# EAGLE design T STorM32 motor v25E-sq (EAGLE 7.5.0)
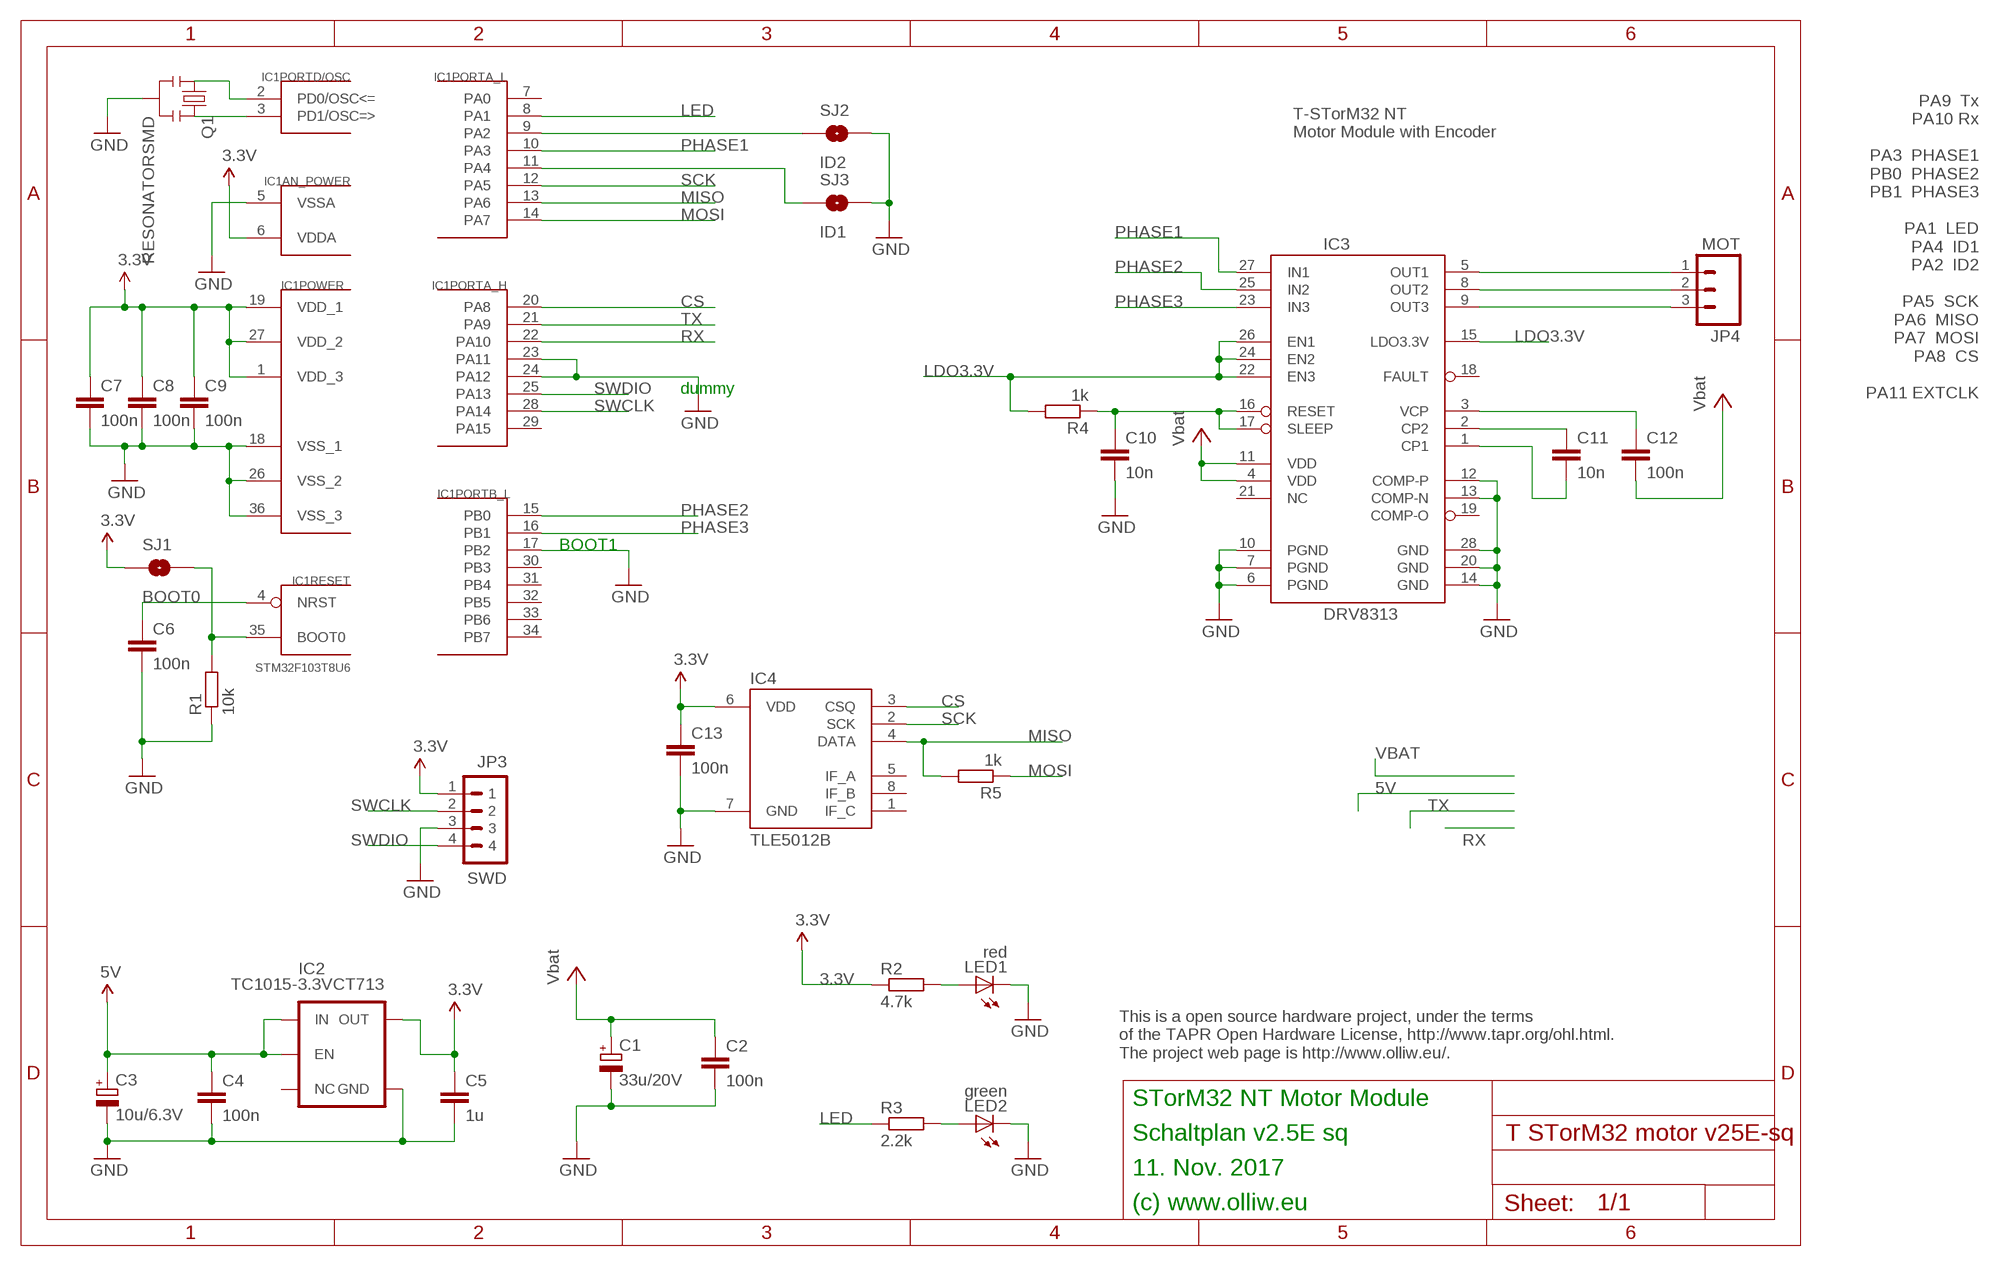
[diagram p0: schematic, sheet 1]

## Parts
C1  33u/20V  CPOL-EUSMCC  [SMC_C]
C2  100n  C-EUC0603  [C0603]
C3  10u/6.3V  CPOL-EUSMCB  [SMC_B]
C4  100n  C-EUC0603  [C0603]
C5  1u  C-EUC0603  [C0603]
C6  100n  C-EUC0603  [C0603]
C7  100n  C-EUC0603  [C0603]
C8  100n  C-EUC0603  [C0603]
C9  100n  C-EUC0603  [C0603]
C10  10n  C-EUC0603  [C0603]
C11  10n  C-EUC0603  [C0603]
C12  100n  C-EUC0603  [C0603]
C13  100n  C-EUC0603  [C0603]
IC1  STM32F103T8U6  STM32F10XTXU6  [VFQFPN36]
IC2  TC1015-3.3VCT713  V_REG_TPS76433SOT23-5  [SOT23-5]
IC3  DRV8313  [HTSSOP28]
IC4  TLE5012B  [SO08]
JP3  SWD  P4X1_1P27-OCT_BILEX  [4X1_1P27_OCT_BILEX]
JP4  MOT  M031X03_NO_SILK  [1X03_NO_SILK]
LED1  red  LEDCHIPLED_0603  [CHIPLED_0603]
LED2  green  LEDCHIPLED_0603  [CHIPLED_0603]
Q1  RESONATORSMD  [RESONATOR-SMD]
R1  10k  R-EU_R0603  [R0603]
R2  4.7k  R-EU_R0603  [R0603]
R3  2.2k  R-EU_R0603  [R0603]
R4  1k  R-EU_R0603  [R0603]
R5  1k  R-EU_R0603  [R0603]
SJ1  BOOT0  SOLDERJUMPERNO  [SJ_2S-NO]
SJ2  ID2  SOLDERJUMPERNO  [SJ_2S-NO]
SJ3  ID1  SOLDERJUMPERNO  [SJ_2S-NO]

## Nets
3.3V: C5.1 C7.1 C8.1 C9.1 C13.1 IC1.1(POWER:VDD_3) IC1.6(AN_POWER:VDDA) IC1.19(POWER:VDD_1) IC1.27(POWER:VDD_2) IC2.5(OUT) IC4.6(VDD) JP3.1 R2.1 SJ1.1
5V: C3.+ C4.1 IC2.1(IN) IC2.3(EN)
CS: IC1.20(PORTA_H:PA8) IC4.3(CSQ)
GND: C1.- C2.2 C3.- C4.2 C5.2 C6.2 C7.2 C8.2 C9.2 C10.2 C13.2 IC1.5(AN_POWER:VSSA) IC1.17(PORTB_L:PB2) IC1.18(POWER:VSS_1) IC1.23(PORTA_H:PA11) IC1.24(PORTA_H:PA12) IC1.26(POWER:VSS_2) IC1.36(POWER:VSS_3) IC2.2(GND) IC3.6(PGND) IC3.7(PGND) IC3.10(PGND) IC3.12(COMP-P) IC3.13(COMP-N) IC3.14(GND) IC3.20(GND) IC3.28(GND) IC4.7(GND) JP3.3 LED1.C LED2.C Q1.2 R1.1 SJ2.2 SJ3.2
LDO3.3V: IC3.15(LDO3.3V) IC3.22(EN3) IC3.24(EN2) IC3.26(EN1) R4.2
LED: IC1.8(PORTA_L:PA1) R3.1
M1: IC3.5(OUT1) JP4.1
M2: IC3.8(OUT2) JP4.2
M3: IC3.9(OUT3) JP4.3
MISO: IC1.13(PORTA_L:PA6) IC4.4(DATA) R5.2
MOSI: IC1.14(PORTA_L:PA7) R5.1
N$3: IC1.9(PORTA_L:PA2) SJ2.1
N$4: IC1.11(PORTA_L:PA4) SJ3.1
N$7: C6.1 IC1.4(RESET:NRST)
N$8: IC1.35(RESET:BOOT0) R1.2 SJ1.2
N$9: IC1.2(PORTD/OSC:PD0/OSC<=) Q1.1
N$10: IC1.3(PORTD/OSC:PD1/OSC=>) Q1.3
N$11: LED1.A R2.2
N$12: LED2.A R3.2
N$16: C11.1 IC3.2(CP2)
N$18: C11.2 IC3.1(CP1)
N$19: C10.1 IC3.16(RESET) IC3.17(SLEEP) R4.1
N$20: C12.1 IC3.3(VCP)
PHASE1: IC1.10(PORTA_L:PA3) IC3.27(IN1)
PHASE2: IC1.15(PORTB_L:PB0) IC3.25(IN2)
PHASE3: IC1.16(PORTB_L:PB1) IC3.23(IN3)
RX: IC1.22(PORTA_H:PA10)
SCK: IC1.12(PORTA_L:PA5) IC4.2(SCK)
SWCLK: IC1.28(PORTA_H:PA14) JP3.2
SWDIO: IC1.25(PORTA_H:PA13) JP3.4
TX: IC1.21(PORTA_H:PA9)
VBAT: C1.+ C2.1 C12.2 IC3.4(VDD) IC3.11(VDD) ; supply symbol labelled Vbat
Unconnected: IC1.7(PORTA_L:PA0) IC1.29(PORTA_H:PA15) IC1.30(PORTB_L:PB3) IC1.31(PORTB_L:PB4) IC1.32(PORTB_L:PB5) IC1.33(PORTB_L:PB6) IC1.34(PORTB_L:PB7) IC2.4(NC) IC3.18(FAULT) IC3.19(COMP-O) IC3.21(NC) IC4.1(IF_C) IC4.5(IF_A) IC4.8(IF_B)

## Notes on the sheet
- PA9  Tx
  PA10 Rx
  
  PA3  PHASE1
  PB0  PHASE2
  PB1  PHASE3
  
  PA1  LED
  PA4  ID1
  PA2  ID2
  
  PA5  SCK
  PA6  MISO
  PA7  MOSI
  PA8  CS
  
  PA11 EXTCLK
- T-STorM32 NT
  Motor Module with Encoder
- dummy
- BOOT1
- This is a open source hardware project, under the terms
  of the TAPR Open Hardware License, http://www.tapr.org/ohl.html.
  The project web page is http://www.olliw.eu/.
- STorM32 NT Motor Module
- Schaltplan v2.5E sq
- 11. Nov. 2017
- (c) www.olliw.eu

## Library data of the parts
C1 C3 = rcl:CPOL-EU: POLARIZED CAPACITOR, European symbol
C2 C4-C13 = rcl:C-EU: CAPACITOR, European symbol
IC1 = # stm32:STM32F10XTXU6: STM32F101/103 36pad VFQPFN36
IC2 = # SparkFun2:V_REG_TPS76433: Voltage Regulator Older TI part. LDO 150mA regulator. No output by-pass cap option. See V_REG_LDO for a better part.
IC3 = # stdlib:DRV8313
IC4 = # stdlib:TLE5012B
JP3 = # stdlib:P4X1_1P27
JP4 = # SparkFun2:M03: Header 3 Standard 3-pin 0.1" header. Use with straight break away headers (SKU : PRT-00116), right angle break away headers (PRT-00553), swiss pins (PRT-00743), machine pins (PRT-00117), and female headers (PRT-00115). Molex polarized connector foot print use with SKU : PRT-08232 with associated crimp pins and housings.
LED1 LED2 = led:LED: LED OSRAM: - CHIPLED LG R971, LG N971, LY N971, LG Q971, LY Q971, LO R971, LY R971 LH N974, LH R974 LS Q976, LO Q976, LY Q976 LO Q996 - Hyper CHIPLED LW Q18S LB Q993, LB Q99A, LB R99A - SideLED LS A670, LO A670, LY A670, LG A670, LP A670 LB A673, LV A673, LT A673, LW A673 LH A674 LY A675 LS A676, LA A676, LO A676, LY A676, LW A676 LS A679, LY A679, LG A679 - Hyper Micro SIDELED® LS Y876, LA Y876, LO Y876, LY Y876 LT Y87S - SmartLED LW L88C, LW L88S LB L89C, LB L89S, LG L890 LS L89K, LO L89K, LY L89K LS L896, LA L896, LO L896, LY L896 - TOPLED LS T670, LO T670, LY T670, LG T670, LP T670 LSG T670, LSP T670, LSY T670, LOP T670, LYG T670 LG T671, LOG T671, LSG T671 LB T673, LV T673, LT T673, LW T673 LH T674 LS T676, LA T676, LO T676, LY T676, LB T676, LH T676, LSB T676, LW T676 LB T67C, LV T67C, LT T67C, LS T67K, LO T67K, LY T67K, LW E67C LS E67B, LA E67B, LO E67B, LY E67B, LB E67C, LV E67C, LT E67C LW T67C LS T679, LY T679, LG T679 LS T770, LO T770, LY T770, LG T770, LP T770 LB T773, LV T773, LT T773, LW T773 LH T774 LS E675, LA E675, LY E675, LS T675 LS T776, LA T776, LO T776, LY T776, LB T776 LHGB T686 LT T68C, LB T68C - Hyper Mini TOPLED® LB M676 - Mini TOPLED Santana® LG M470 LS M47K, LO M47K, LY M47K Source: http://www.osram.convergy.de LUXEON: - LUMILED® LXK2-PW12-R00, LXK2-PW12-S00, LXK2-PW14-U00, LXK2-PW14-V00 LXK2-PM12-R00, LXK2-PM12-S00, LXK2-PM14-U00 LXK2-PE12-Q00, LXK2-PE12-R00, LXK2-PE12-S00, LXK2-PE14-T00, LXK2-PE14-U00 LXK2-PB12-K00, LXK2-PB12-L00, LXK2-PB12-M00, LXK2-PB14-N00, LXK2-PB14-P00, LXK2-PB14-Q00 LXK2-PR12-L00, LXK2-PR12-M00, LXK2-PR14-Q00, LXK2-PR14-R00 LXK2-PD12-Q00, LXK2-PD12-R00, LXK2-PD12-S00 LXK2-PH12-R00, LXK2-PH12-S00 LXK2-PL12-P00, LXK2-PL12-Q00, LXK2-PL12-R00 Source: www.luxeon.com KINGBRIGHT: KA-3528ASYC Source: www.kingbright.com
Q1 = # SparkFun2:RESONATOR: Resonator Small SMD resonator. This is the itty bitty 10/20MHz resonators with built in caps. CSTCE10M0G55 and CSTCE20M0V53. Footprint has been reviewed closely but hasn't been tested yet.
R1-R5 = rcl:R-EU_: RESISTOR, European symbol
SJ1-SJ3 = # SparkFun2:SOLDERJUMPER: Solder Jumper Standard SMD solder jumper. Used to automate production. Two varients : Normally Open and Normally Closed are the same, but have different paste layers. NC will have a large amount of paste and should jumper during reflow.

## Board
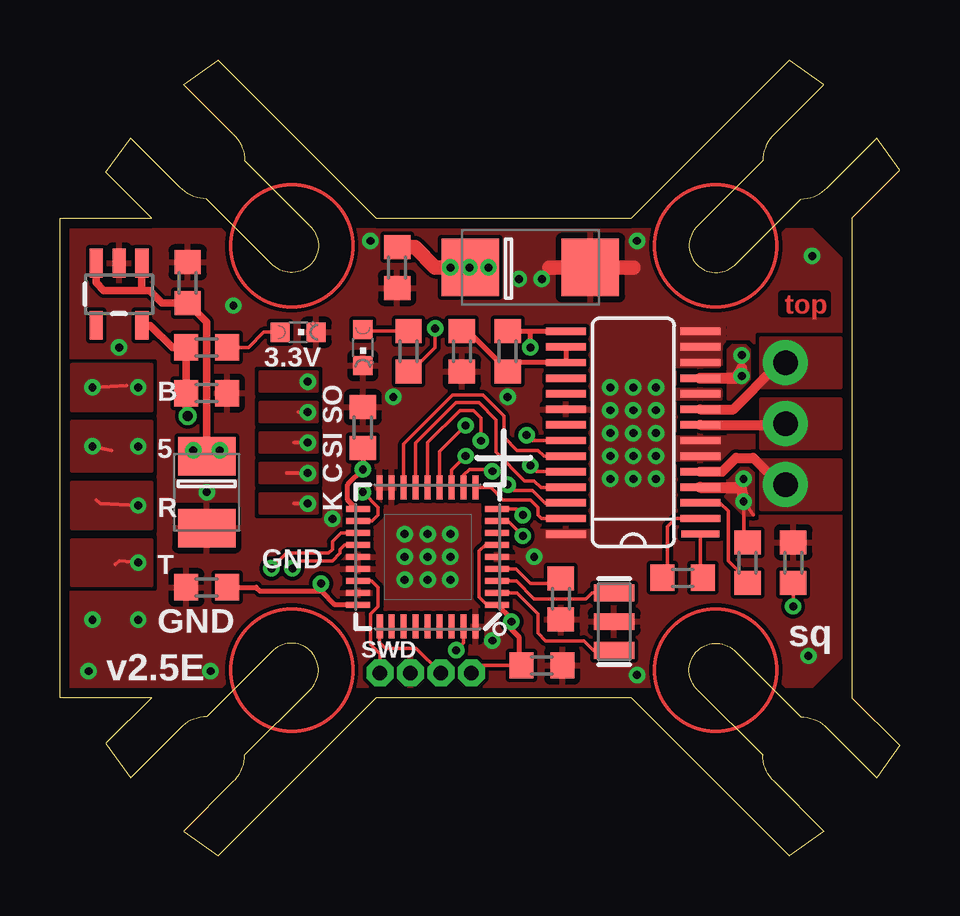
[diagram p1: board, top side]
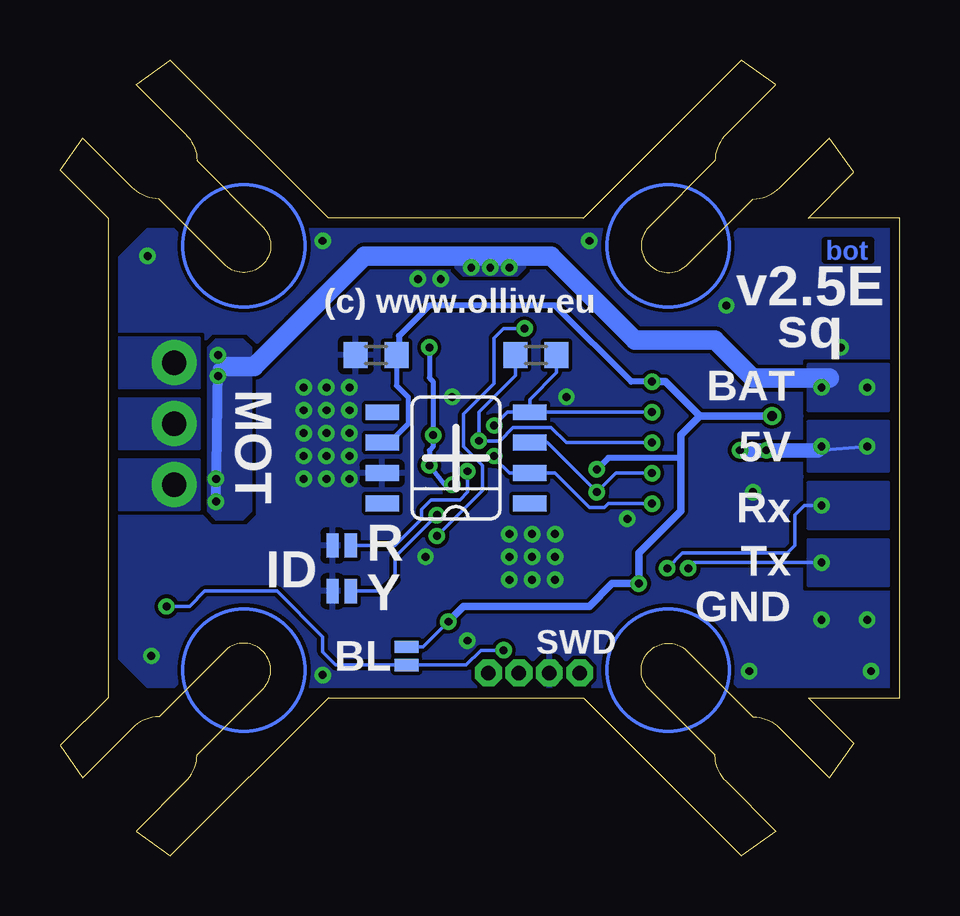
[diagram p2: board, bottom side, seen from below]

Size 35.01 x 33.18 mm. Coordinates in mm from the lower left corner, seen from the top.
Outline: 0,6.59 0,26.59 3.82,26.59 1.91,28.5 2.94,29.92 5.01,27.86 arc46 6.12,27.38 8.9,24.61 arc180 10.4,26.27 7.71,28.97 arc45 7.23,30.08 5.17,32.15 6.59,33.18 13.18,26.59 23.82,26.59 30.41,33.18 31.83,32.15 29.77,30.08 arc45 29.29,28.97 26.6,26.27 arc180 28.1,24.61 30.88,27.38 arc46 31.99,27.86 34.06,29.92 35.01,28.58 33,26.59 33,6.59 35.01,4.6 34.06,3.25 31.99,5.32 arc46 30.88,5.79 28.1,8.57 arc180 26.6,6.91 29.29,4.21 arc45 29.77,3.1 31.83,1.03 30.41,0 23.82,6.59 13.18,6.59 6.59,0 5.17,1.03 7.23,3.1 arc45 7.71,4.21 10.4,6.91 arc180 8.9,8.57 6.12,5.79 arc46 5.01,5.32 2.94,3.25 1.91,4.68 3.82,6.59 0,6.59
Copper layers (1*16): Top 0.0356mm / dielectric 1.5011mm / Bottom 0.0356mm
Design rules "ow-oshpark-2layer": minimum track width 6mil, minimum drill 13mil, track to track 6mil, track to pad 6mil, pad to pad 6mil, via to via 6mil, smd to smd 6mil, copper to edge 15mil, drill to drill 6mil, minimum pad ring 7mil, minimum via ring 7mil, stop-mask expansion 2.5mil, vias tented up to drill 26mil, thermal gap 10mil

### Footprints (pad centres in the part's own frame; a part is rotated, then mirrored left to right if it is on the bottom)
SMC_C = smd 2.4 x 2.4: + -2.5,0; - 2.5,0
C0603 = smd 1 x 1.1: 1 -0.85,0; 2 0.85,0
SMC_B = smd 1.6 x 2.4: + -1.5,0; - 1.5,0
VFQFPN36 = smd 1 x 0.25: 1 -2.9,2; 2 -2.9,1.5; 3 -2.9,1; 4 -2.9,0.5; 5 -2.9,0; 6 -2.9,-0.5; 7 -2.9,-1; 8 -2.9,-1.5; 9 -2.9,-2; 19 2.9,-2; 20 2.9,-1.5; 21 2.9,-1; 22 2.9,-0.5; 23 2.9,0; 24 2.9,0.5; 25 2.9,1; 26 2.9,1.5; 27 2.9,2 | smd 0.25 x 1: 10 -2,-2.9; 11 -1.5,-2.9; 12 -1,-2.9; 13 -0.5,-2.9; 14 0,-2.9; 15 0.5,-2.9; 16 1,-2.9; 17 1.5,-2.9; 18 2,-2.9; 29 1.5,2.9; 30 1,2.9; 31 0.5,2.9; 32 0,2.9; 33 -0.5,2.9; 34 -1,2.9; 35 -1.5,2.9; 36 -2,2.9 | smd 0.27 x 1: 28 2,2.9
SOT23-5 = smd 0.55 x 1.2: 1 -0.95,-1.3; 2 0,-1.3; 3 0.95,-1.3; 4 0.95,1.3; 5 -0.95,1.3
HTSSOP28 = smd 0.3 x 1.6: 1 0,-2.8 | smd 0.305 x 1.676: 2 0.65,-2.8; 3 1.3,-2.8; 4 1.95,-2.8; 5 2.6,-2.8; 6 3.25,-2.8; 7 3.9,-2.8; 8 4.55,-2.8; 9 5.2,-2.8; 10 5.85,-2.8; 11 6.5,-2.8; 12 7.15,-2.8; 13 7.8,-2.8; 14 8.45,-2.8; 15 8.45,2.8; 16 7.8,2.8; 17 7.15,2.8; 18 6.5,2.8; 19 5.85,2.8; 20 5.2,2.8; 21 4.55,2.8; 22 3.9,2.8; 23 3.25,2.8; 24 2.6,2.8; 25 1.95,2.8; 26 1.3,2.8; 27 0.65,2.8; 28 0,2.8
SO08 = smd 0.66 x 1.397: 1 0,-3.073; 2 1.27,-3.073; 3 2.54,-3.073; 4 3.81,-3.073; 5 3.81,3.073; 6 2.54,3.073; 7 1.27,3.073; 8 0,3.073
4X1_1P27_OCT_BILEX = drill 0.61 pad 1.118 octagon: 1 0,0; 2 0,-1.27; 3 0,-2.54; 4 0,-3.81
1X03_NO_SILK = drill 1.016 pad 1.88: 1 0,0; 2 2.54,0; 3 5.08,0
CHIPLED_0603 = smd 0.8 x 0.8: A 0,-0.75; C 0,0.75
RESONATOR-SMD = smd 0.7 x 1.7: 1 -1.2,0; 2 0,0; 3 1.2,0
R0603 = smd 1 x 1.1: 1 -0.85,0; 2 0.85,0
SJ_2S-NO = smd 0.508 x 1.016: 1 -0.381,0; 2 0.381,0

### Placement (x,y rotation side)
C1  19.61,24.53 0 top
C2  14.05,24.53 270 top
C3  6.12,15.16 270 top
C4  5.32,23.89 90 top
C5  6.12,19.29 0 top
C6  20.88,10.72 270 top
C7  6.12,11.19 180 top
C8  12.63,17.86 90 top
C9  20.09,7.94 0 top
C10  16.75,21.03 270 top
C11  25.96,11.59 0 top
C12  28.66,12.22 90 top
C13  21.83,20.88 180 bottom
IC1  15.32,12.46 180 top
IC2  2.47,23.42 180 top
IC3  23.9,13.41 90 top
IC4  18.5,14.68 90 bottom
JP3  17.15,7.62 270 top
JP4  30.25,15.48 90 top
LED1  9.93,21.83 270 top
LED2  12.63,21.19 180 top
Q1  23.1,9.76 90 top
R1  30.56,12.22 270 top
R2  6.12,21.19 0 top
R3  14.53,21.03 90 top
R4  18.66,21.03 90 top
R5  15.17,20.88 0 bottom
SJ1  20.56,8.33 270 bottom
SJ2  23.26,11.03 180 bottom
SJ3  23.26,12.94 180 bottom

### Tracks (layer width: path | path; a pad name or v marks a point on that pad's centre or on a via)
3.3V  (via drill 0.33, 0.4)
  Top 0.152: JP3.1 17.47,7.94 C9.1 19.13,8.04 | IC1.19 12.37,14.46 | IC1.6 17.73,12.96 17.47,12.7 17.47,10.8 17.8,10.46 IC1.1
  Top 0.203: 10.88,11.03 11.45,10.46 IC1.27 | 12.37,14.46 11.99,14.84 11.99,15.48 v12.63,16.11 C8.1 | C7.1 8.18,11.19 8.34,11.03 10.88,11.03 | 10.88,11.03 v10.88,11.35 | 19.13,8.04 19.13,9.13 18.82,9.45 v18.82,9.76 18.82,9.87 IC1.1
  Top 0.305: IC2.5 3.77,22.12 4.69,21.19 R2.1 C5.1 5.27,18.39 v5.32,18.34
  Bottom 0.152: IC4.6 21.28,17.22 | 20.88,20.98 C13.1 | v18.82,9.76 19.86,8.72 SJ1.1
  Bottom 0.203: 21.28,17.22 20.48,18.02 20.48,19.11 20.98,19.61 C13.1
  Bottom 0.254: 9.13,16.59 12.15,16.59 v12.63,16.11 | 20.88,20.98 20.88,21.67 19.61,22.94 14.37,22.94 11.2,19.76 v10.32,19.76
  Bottom 0.305: v18.82,9.76 18.18,10.4 12.94,10.4 11.99,11.35 v10.88,11.35 10.88,12.62 9.13,14.37 9.13,16.59 9.13,17.54 8.34,18.34 | v5.32,18.34 8.34,18.34 | 8.34,18.34 9.77,19.76 v10.32,19.76
  pour Top: 8.34,20.16 10.72,20.16 10.72,19.37 8.34,19.37
5V  (via drill 0.33)
  Top 0.152: v1.35,17.07 2.15,16.91 | C3.+ v5.55,16.91 5.87,17.14 6.12,17.38 | 3.42,23.58 3.26,23.57
  Top 0.305: IC2.3 1.52,23.89 1.83,23.57 3.26,23.57 3.74,23.57 4.27,23.04 C4.1 6.12,22.25 6.12,17.38 | IC2.1 3.42,23.58
  Bottom 0.152: 3.42,16.91 v1.35,17.07
  Bottom 0.61: v6.67,16.91 v5.55,16.91 3.42,16.91
  other vias: 3.26,17.07
  pour Top: 0.48,18.1 3.82,18.1 3.82,16.03 0.48,16.03
  pour Bottom: 0.48,18.1 3.82,18.1 3.82,16.03 0.48,16.03
CS  (via drill 0.33)
  Top 0.152: IC1.20 13.01,13.96 13.26,14.21 13.26,14.53 v12.63,15.16 | v10.32,15.95 9.45,15.95
  Bottom 0.152: IC4.3 14.69,17.22 v12.63,15.16 11.83,15.95 v10.32,15.95
  pour Top: 8.34,16.35 10.72,16.35 10.72,15.56 8.34,15.56
GND  (via drill 0.33)
  Top 0.61: 20.4,24.53 23.9,24.53
  other vias: 16.28,11.51 14.37,12.46 22.95,17.62 22.95,16.67 15.32,12.46 14.37,13.41 15.32,13.41 16.28,13.41 16.28,12.46 14.37,11.51 15.32,11.51 22.95,18.57 23.9,19.53 23.9,18.57 23.9,17.62 23.9,16.67 23.9,15.72 24.85,19.53 24.85,18.57 24.85,17.62 24.85,16.67 24.85,15.72 22.95,19.53 22.95,15.72 1.2,7.7 20.09,24.05 19.13,24.05 12.94,25.64 24.06,25.64 31.36,25 31.2,8.33 7.23,22.94 2.47,21.19 6.12,15.16 6.28,7.7 18.66,19.13 13.9,19.13 11.36,14.05 19.77,12.46 18.02,8.97 24.06,7.54 3.26,9.84 1.35,9.84
  pour Top (no thermals): 27.55,20.48 27.47,20.4 25.33,20.4 25.33,22.3 27.71,22.3 27.71,21.43 27.55,21.27
  pour Top (no thermals): 27.87,16.51 25.33,16.51 25.33,17.46 27.87,17.46
  pour Top (no thermals): 27.55,19.05 25.48,19.05 25.48,19.45 27.55,19.45
  pour Top (no thermals): 22.31,13.02 19.93,13.02 19.93,13.57 22.31,13.57
  pour Top (rank 2): 0.08,26.11 31.36,26.11 32.63,24.84 32.63,8.33 31.36,7.06 0.08,7.06
  pour Bottom (rank 2): 0.08,26.11 31.36,26.11 32.63,24.84 32.63,8.33 31.36,7.06 0.08,7.06
LDO3.3V  (via drill 0.33)
  Top 0.152: 18.52,21.86 R4.2 | IC3.26 20.22,14.71 19.69,15.24 18.9,15.24 v18.66,15.48 | IC3.24 19.87,16.01 v19.61,16.27 | IC3.22 19.68,17.31 v19.45,17.54
  Top 0.203: IC3.15 19.61,21.86 | 19.61,21.86 18.52,21.86 | v19.61,21.19 19.61,21.86
  Bottom 0.203: v19.61,21.19 19.61,19.92 19.45,19.76 v19.45,17.54 19.45,17.07 19.61,16.91 v19.61,16.27 18.98,15.48 v18.66,15.48
LED  (via drill 0.33)
  Top 0.152: IC1.8 18.67,13.96 v19.29,13.34 | v15.64,21.99 15.64,21.19 14.63,20.18 R3.1
  Bottom 0.152: v19.29,13.34 17.39,15.24 17.39,16.27 18.18,17.07 18.18,18.42 16.91,19.69 16.91,21.59 16.52,21.99 v15.64,21.99
M1
  Top 0.406: IC3.5 27.61,16.01 28.18,16.59 28.9,16.59 30.01,15.48 JP4.1
  pour Top (no thermals): 29.22,16.51 32.55,16.51 32.55,14.45 29.22,14.45
  pour Bottom (no thermals): 29.22,16.51 32.55,16.51 32.55,14.45 29.22,14.45
M2
  Top 0.406: IC3.8 30.19,17.96 JP4.2
  pour Top (no thermals): 29.22,19.05 32.55,19.05 32.55,16.99 29.22,16.99
  pour Bottom (no thermals): 29.22,19.05 32.55,19.05 32.55,16.99 29.22,16.99
M3
  Top 0.406: IC3.9 28.07,18.61 29.85,20.4 JP4.3
  pour Top (no thermals): 29.22,21.59 32.55,21.59 32.55,19.53 29.22,19.53
  pour Bottom (no thermals): 29.22,21.59 32.55,21.59 32.55,19.53 29.22,19.53
MISO  (via drill 0.33)
  Top 0.152: IC1.13 15.82,16.85 v16.91,17.94 | v10.32,18.49 9.93,18.49
  Bottom 0.152: R5.2 14.32,20.14 15.43,19.03 IC4.4 | IC4.4 v10.32,18.49 | IC4.4 16.36,18.49 v16.91,17.94
  pour Top: 8.34,18.89 10.72,18.89 10.72,18.1 8.34,18.1
MOSI  (via drill 0.33)
  Top 0.152: IC1.14 15.32,17.22 16.67,18.57 17.23,18.57 17.55,18.26 v17.55,17.3 | v10.32,17.22 9.77,17.22
  Bottom 0.152: R5.1 16.02,20.03 17.55,18.49 v17.55,17.3 16.67,17.3 16.12,17.86 14.53,17.86 13.9,17.22 v10.32,17.22
  pour Top: 8.34,17.62 10.72,17.62 10.72,16.83 8.34,16.83
N$3  (via drill 0.33)
  Top 0.152: IC1.9 19.04,14.46 v19.29,14.21
  Bottom 0.152: v19.29,14.21 21.04,12.46 21.04,11.51 21.52,11.03 SJ2.1
N$4  (via drill 0.33)
  Top 0.152: IC1.11 16.82,15.87 17.07,16.11 17.94,16.11 v18.02,16.03
  Bottom 0.152: v18.02,16.03 18.02,15.16 18.34,14.84 19.53,14.84 19.93,14.45 19.93,14.05 21.04,12.94 SJ3.1
N$7
  Top 0.152: IC1.4 19,11.96 19.61,11.35 20.67,11.35 C6.1
N$8  (via drill 0.33)
  Top 0.152: IC1.35 16.82,8.88 v16.52,8.57 | R1.2 v30.56,10.4
  Bottom 0.152: v16.52,8.57 17.47,8.57 18.09,7.95 SJ1.2 23.52,7.95 24.06,8.49 24.06,9.13 25.96,11.03 28.98,11.03 29.61,10.4 v30.56,10.4
N$9
  Top 0.152: IC1.2 19.05,10.96 19.93,10.08 19.93,9.29 20.25,8.97 21.83,8.97 22.24,8.56 Q1.1
N$10
  Top 0.152: IC1.3 19.02,11.46 19.77,10.72 21.92,10.72 22.17,10.96 Q1.3
N$11
  Top 0.152: LED1.A 8.5,21.83 7.86,21.19 R2.2
N$12
  Top 0.152: R3.2 12.68,21.88 LED2.A
N$16
  Top 0.152: IC3.2 25.66,14.06 25.33,13.73 25.33,11.72 C11.1
N$18
  Top 0.152: IC3.1 26.7,11.78 C11.2
N$19
  Top 0.152: 18.66,20.24 18.44,20.18 R4.1 18.66,20.24 | 18.66,20.24 18.82,20.56 | C10.1 17.02,21.88
  Top 0.203: IC3.16 IC3.17 18.82,20.56 | 17.02,21.88 18.66,20.24
N$20
  Top 0.152: IC3.3 27.52,14.71 27.87,14.37 27.87,12.3 28.5,11.67 28.92,11.51 C12.1
PHASE1
  Top 0.152: IC3.27 20.07,14.06 19.93,14.21 19.93,14.53 19.61,14.84 18.48,14.84 17.96,15.36 IC1.10
PHASE2
  Top 0.152: IC1.15 14.82,17.2 16.52,18.89 17.47,18.89 18.18,18.18 18.18,16.83 19.37,15.64 19.77,15.64 20.04,15.36 IC3.25
PHASE3
  Top 0.152: IC1.16 14.32,17.18 16.36,19.21 17.63,19.21 18.5,18.34 18.5,17.46 19.06,16.91 19.93,16.91 20.17,16.66 IC3.23
RX  (via drill 0.33)
  Top 0.152: IC1.22 11.86,12.96 11.67,12.78 11.67,12.62 11.36,12.3 10.01,12.3 v9.69,11.99 | v3.26,14.61 1.67,14.68 1.51,14.84
  Bottom 0.152: 3.1,14.84 v3.26,14.61 3.97,14.61 4.37,14.21 4.37,12.94 4.69,12.62 9.05,12.62 v9.69,11.99
  pour Top: 0.48,15.56 3.82,15.56 3.82,13.65 0.48,13.65
  pour Bottom: 0.48,15.56 3.82,15.56 3.82,13.65 0.48,13.65
SCK  (via drill 0.33)
  Top 0.152: IC1.12 16.32,16.08 v16.91,16.67 | v10.32,14.68 9.77,14.68
  Bottom 0.152: v10.32,14.68 12.15,14.68 12.31,14.53 12.94,14.53 14.37,15.95 IC4.2 16.28,15.95 16.91,16.59 v16.91,16.67
  pour Top: 8.34,15.08 10.72,15.08 10.72,14.29 8.34,14.29
SWCLK
  Top 0.152: IC1.28 13.32,8.91 13.58,8.65 14.85,8.65 JP3.2
SWDIO
  Top 0.152: IC1.25 12.99,11.46 13.26,11.19 13.26,10.4 12.94,10.08 12.94,8.81 13.34,8.41 JP3.4
TX  (via drill 0.33)
  Top 0.152: IC1.21 11.72,13.46 11.36,13.1 11.36,12.78 11.2,12.62 9.45,12.62 v8.82,11.99 | v3.26,12.22 2.47,12.3 2.31,12.14
  Bottom 0.152: v3.26,12.22 8.58,12.22 v8.82,11.99
  pour Top: 0.48,13.18 3.82,13.18 3.82,11.27 0.48,11.27
  pour Bottom: 0.48,13.18 3.82,13.18 3.82,11.27 0.48,11.27
VBAT  (via drill 0.33)
  Top 0.152: 28.9,14.21 v28.5,14.76 | 28.26,14.84 v28.5,14.76 | C12.2 28.76,13.15 28.5,13.41 v28.5,14.76 | v1.35,19.53 2.78,19.61 | v16.28,24.53 v17.07,24.53 C1.+ v17.86,24.53
  Top 0.457: IC3.11 28.18,19.91 28.42,20.32 | IC3.4 28.38,15.36 v28.5,14.76
  Top 0.61: C2.1 14.79,25.38 15.64,24.53 v16.28,24.53
  Bottom 0.152: 2.94,19.92 v3.26,19.53 | v16.28,24.53 15.48,25 | 28.02,20.4 v28.42,20
  Bottom 0.406: v28.5,14.76 28.42,20.32
  Bottom 0.813: 2.94,19.92 6.12,19.92 7.71,21.51 11.04,21.51 14.53,25 15.48,25 22.31,25 26.91,20.4 28.02,20.4
  other vias: 28.42,20.88 28.5,15.72
  pour Bottom: 27.07,21.19 27.07,14.37 27.39,14.05 28.5,14.05 28.82,14.37 28.82,21.19 28.5,21.51 27.39,21.51
  pour Top: 27.39,15.64 27.87,15.64 28.42,16.19 28.66,16.19 28.9,15.95 28.9,14.21 28.5,14.21 27.63,15.08 27.39,15.08
  pour Top: 27.39,20.08 27.39,19.84 27.71,19.84 27.87,19.68 27.87,19.05 27.95,18.97 28.26,18.97 28.74,19.45 28.74,21.11 28.58,21.27 28.02,21.27 27.87,21.11 27.87,20.24 27.71,20.08
  pour Top: 3.82,20.48 3.82,18.57 0.48,18.57 0.48,20.48
  pour Bottom: 0.48,20.48 3.82,20.48 3.82,18.57 0.48,18.57
  pour Bottom: 15.64,25 15.64,24.53 15.96,24.21 18.18,24.21 18.5,24.53 18.5,25
(copper drawn outside any net)
  shapes: Bottom circle x4, Top circle x4

### Text on the board
Top: top
Bottom: bot
tNames: 3.3V | B | SO | 5 | SI | C | R | K | GND | T | GND | SWD | sq | v2.5E
bNames: v2.5E | (c) www.olliw.eu | sq | BAT | MOT | 5V | Rx | Tx | R | GND | ID | Y | SWD | BL